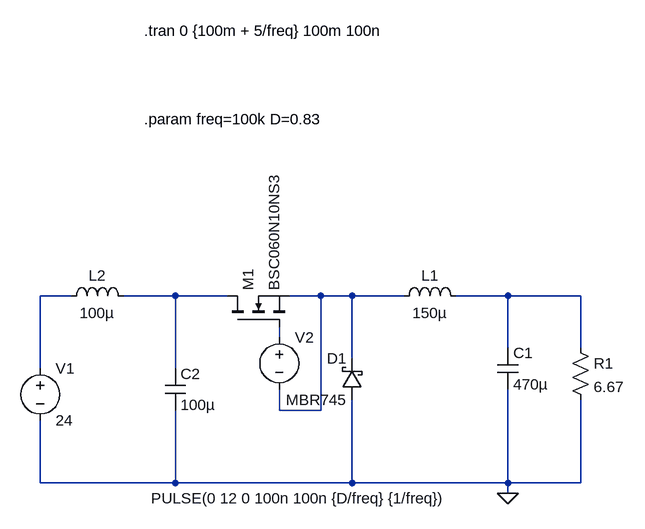
[diagram p0: schematic buck_simplified.asc]
buck_simplified.asc, the LTspice schematic file:
Version 4
SHEET 1 880 680
WIRE -112 16 -160 16
WIRE 48 16 -32 16
WIRE 128 16 48 16
WIRE 272 16 224 16
WIRE 320 16 272 16
WIRE 400 16 320 16
WIRE 560 16 480 16
WIRE 672 16 560 16
WIRE 208 80 208 64
WIRE 560 96 560 16
WIRE 672 96 672 16
WIRE 320 112 320 16
WIRE -160 128 -160 16
WIRE 48 128 48 16
WIRE 208 192 208 160
WIRE 272 192 272 16
WIRE 272 192 208 192
WIRE -160 304 -160 208
WIRE 48 304 48 192
WIRE 48 304 -160 304
WIRE 320 304 320 176
WIRE 320 304 48 304
WIRE 560 304 560 160
WIRE 560 304 320 304
WIRE 672 304 672 176
WIRE 672 304 560 304
WIRE 560 320 560 304
FLAG 560 320 0
SYMBOL voltage -160 112 R0
WINDOW 123 0 0 Left 0
WINDOW 39 0 0 Left 0
SYMATTR InstName V1
SYMATTR Value 24
SYMBOL schottky 336 176 R180
WINDOW 0 24 64 Left 2
WINDOW 3 24 0 Left 2
SYMATTR InstName D1
SYMATTR Value MBR745
SYMATTR Description Diode
SYMATTR Type diode
SYMBOL nmos 128 64 R270
SYMATTR InstName M1
SYMATTR Value BSC060N10NS3
SYMBOL ind 384 32 R270
WINDOW 0 32 56 VTop 2
WINDOW 3 5 56 VBottom 2
SYMATTR InstName L1
SYMATTR Value 150µ
SYMBOL cap 544 96 R0
SYMATTR InstName C1
SYMATTR Value 470µ
SYMBOL res 656 80 R0
SYMATTR InstName R1
SYMATTR Value 6.67
SYMBOL voltage 208 64 R0
WINDOW 3 -197 264 Left 2
WINDOW 123 0 0 Left 0
WINDOW 39 0 0 Left 0
SYMATTR Value PULSE(0 12 0 100n 100n {D/freq} {1/freq})
SYMATTR InstName V2
SYMBOL cap 32 128 R0
SYMATTR InstName C2
SYMATTR Value 100µ
SYMBOL ind -128 32 R270
WINDOW 0 32 56 VTop 2
WINDOW 3 5 56 VBottom 2
SYMATTR InstName L2
SYMATTR Value 100µ
TEXT 0 -256 Left 2 !.param freq=100k D=0.83
TEXT 0 -392 Left 2 !.tran 0 {100m + 5/freq} 100m 100n

The netlist it stands for:
* buck_simplified.asc
V1 N001 0 24
D1 0 N003 MBR745
M1 N002 N005 N003 N003 BSC060N10NS3
L1 N003 N004 150µ
C1 N004 0 470µ
R1 N004 0 6.67
V2 N005 N003 PULSE(0 12 0 100n 100n {D/freq} {1/freq})
C2 N002 0 100µ
L2 N001 N002 100µ
.model D D
.lib standard.dio
.model NMOS NMOS
.model PMOS PMOS
.lib standard.mos
.param freq=100k D=0.83
.tran 0 {100m + 5/freq} 100m 100n
.backanno
.end